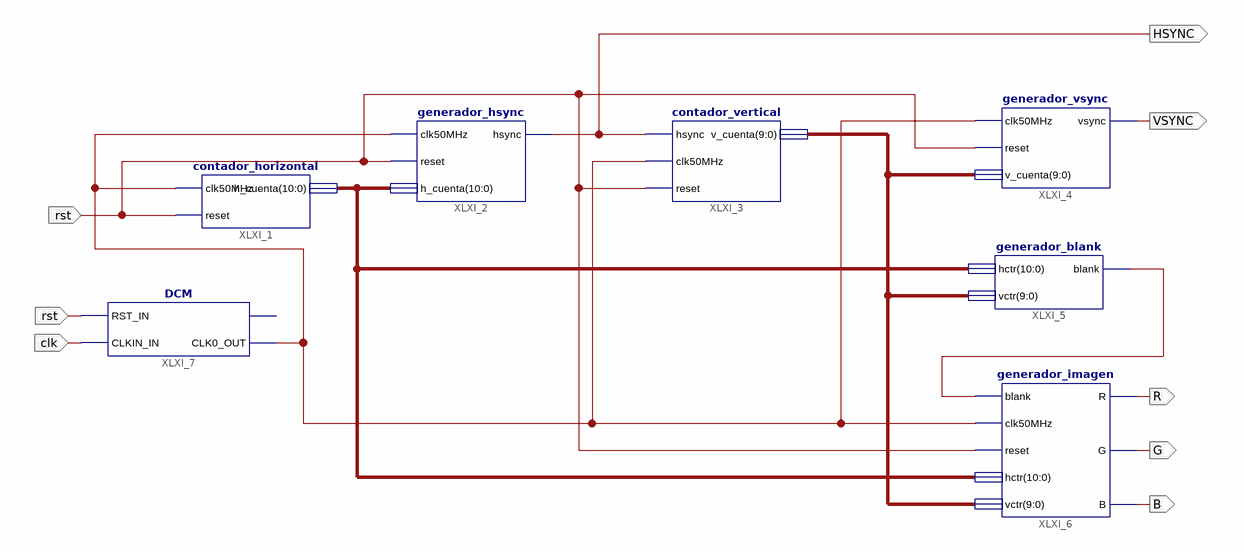
[diagram p0: schematic sheet 1]
// Xilinx ISE schematic Prueba_VGA.sch (spartan3e) as structural Verilog: 7 symbols, 7 ports
module Prueba_VGA (
  input  rst,
  input  clk,
  output R,
  output G,
  output B,
  output VSYNC,
  output HSYNC
);

  wire XLXN_15, XLXN_16;
  wire [9:0] XLXN_5;
  wire [10:0] XLXN_1;

  contador_horizontal XLXI_1 (.clk50MHz(XLXN_15), .reset(rst), .h_cuenta(XLXN_1));
  generador_hsync XLXI_2 (.clk50MHz(XLXN_15), .reset(rst), .h_cuenta(XLXN_1), .hsync(HSYNC));
  contador_vertical XLXI_3 (.hsync(HSYNC), .clk50MHz(XLXN_15), .reset(rst), .v_cuenta(XLXN_5));
  generador_vsync XLXI_4 (.clk50MHz(XLXN_15), .reset(rst), .v_cuenta(XLXN_5), .vsync(VSYNC));
  generador_blank XLXI_5 (.hctr(XLXN_1), .vctr(XLXN_5), .blank(XLXN_16));
  generador_imagen XLXI_6 (
    .blank(XLXN_16), .clk50MHz(XLXN_15), .reset(rst), .hctr(XLXN_1), .vctr(XLXN_5), .R(R), .G(G), .B(B));
  DCM XLXI_7 (.RST_IN(rst), .CLKIN_IN(clk), .CLK0_OUT(XLXN_15));  // open: CLKIN_IBUFG_OUT
endmodule
